# EAGLE schematic flight_computer_board_2017_12_11 (EAGLE 8.4.3)
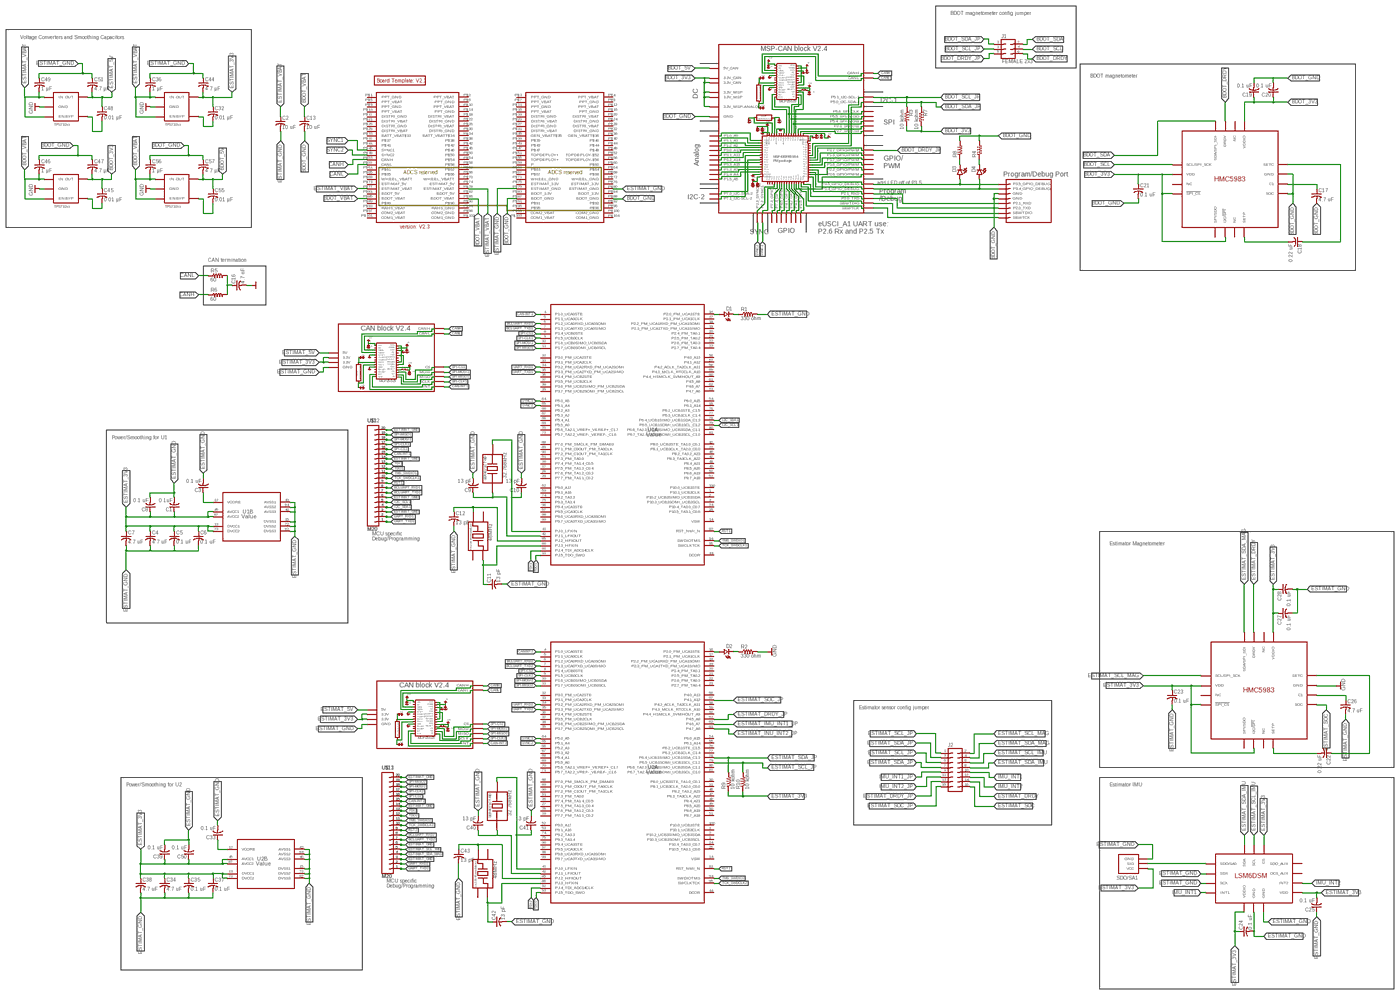
[diagram p0: schematic, sheet 1, overview]
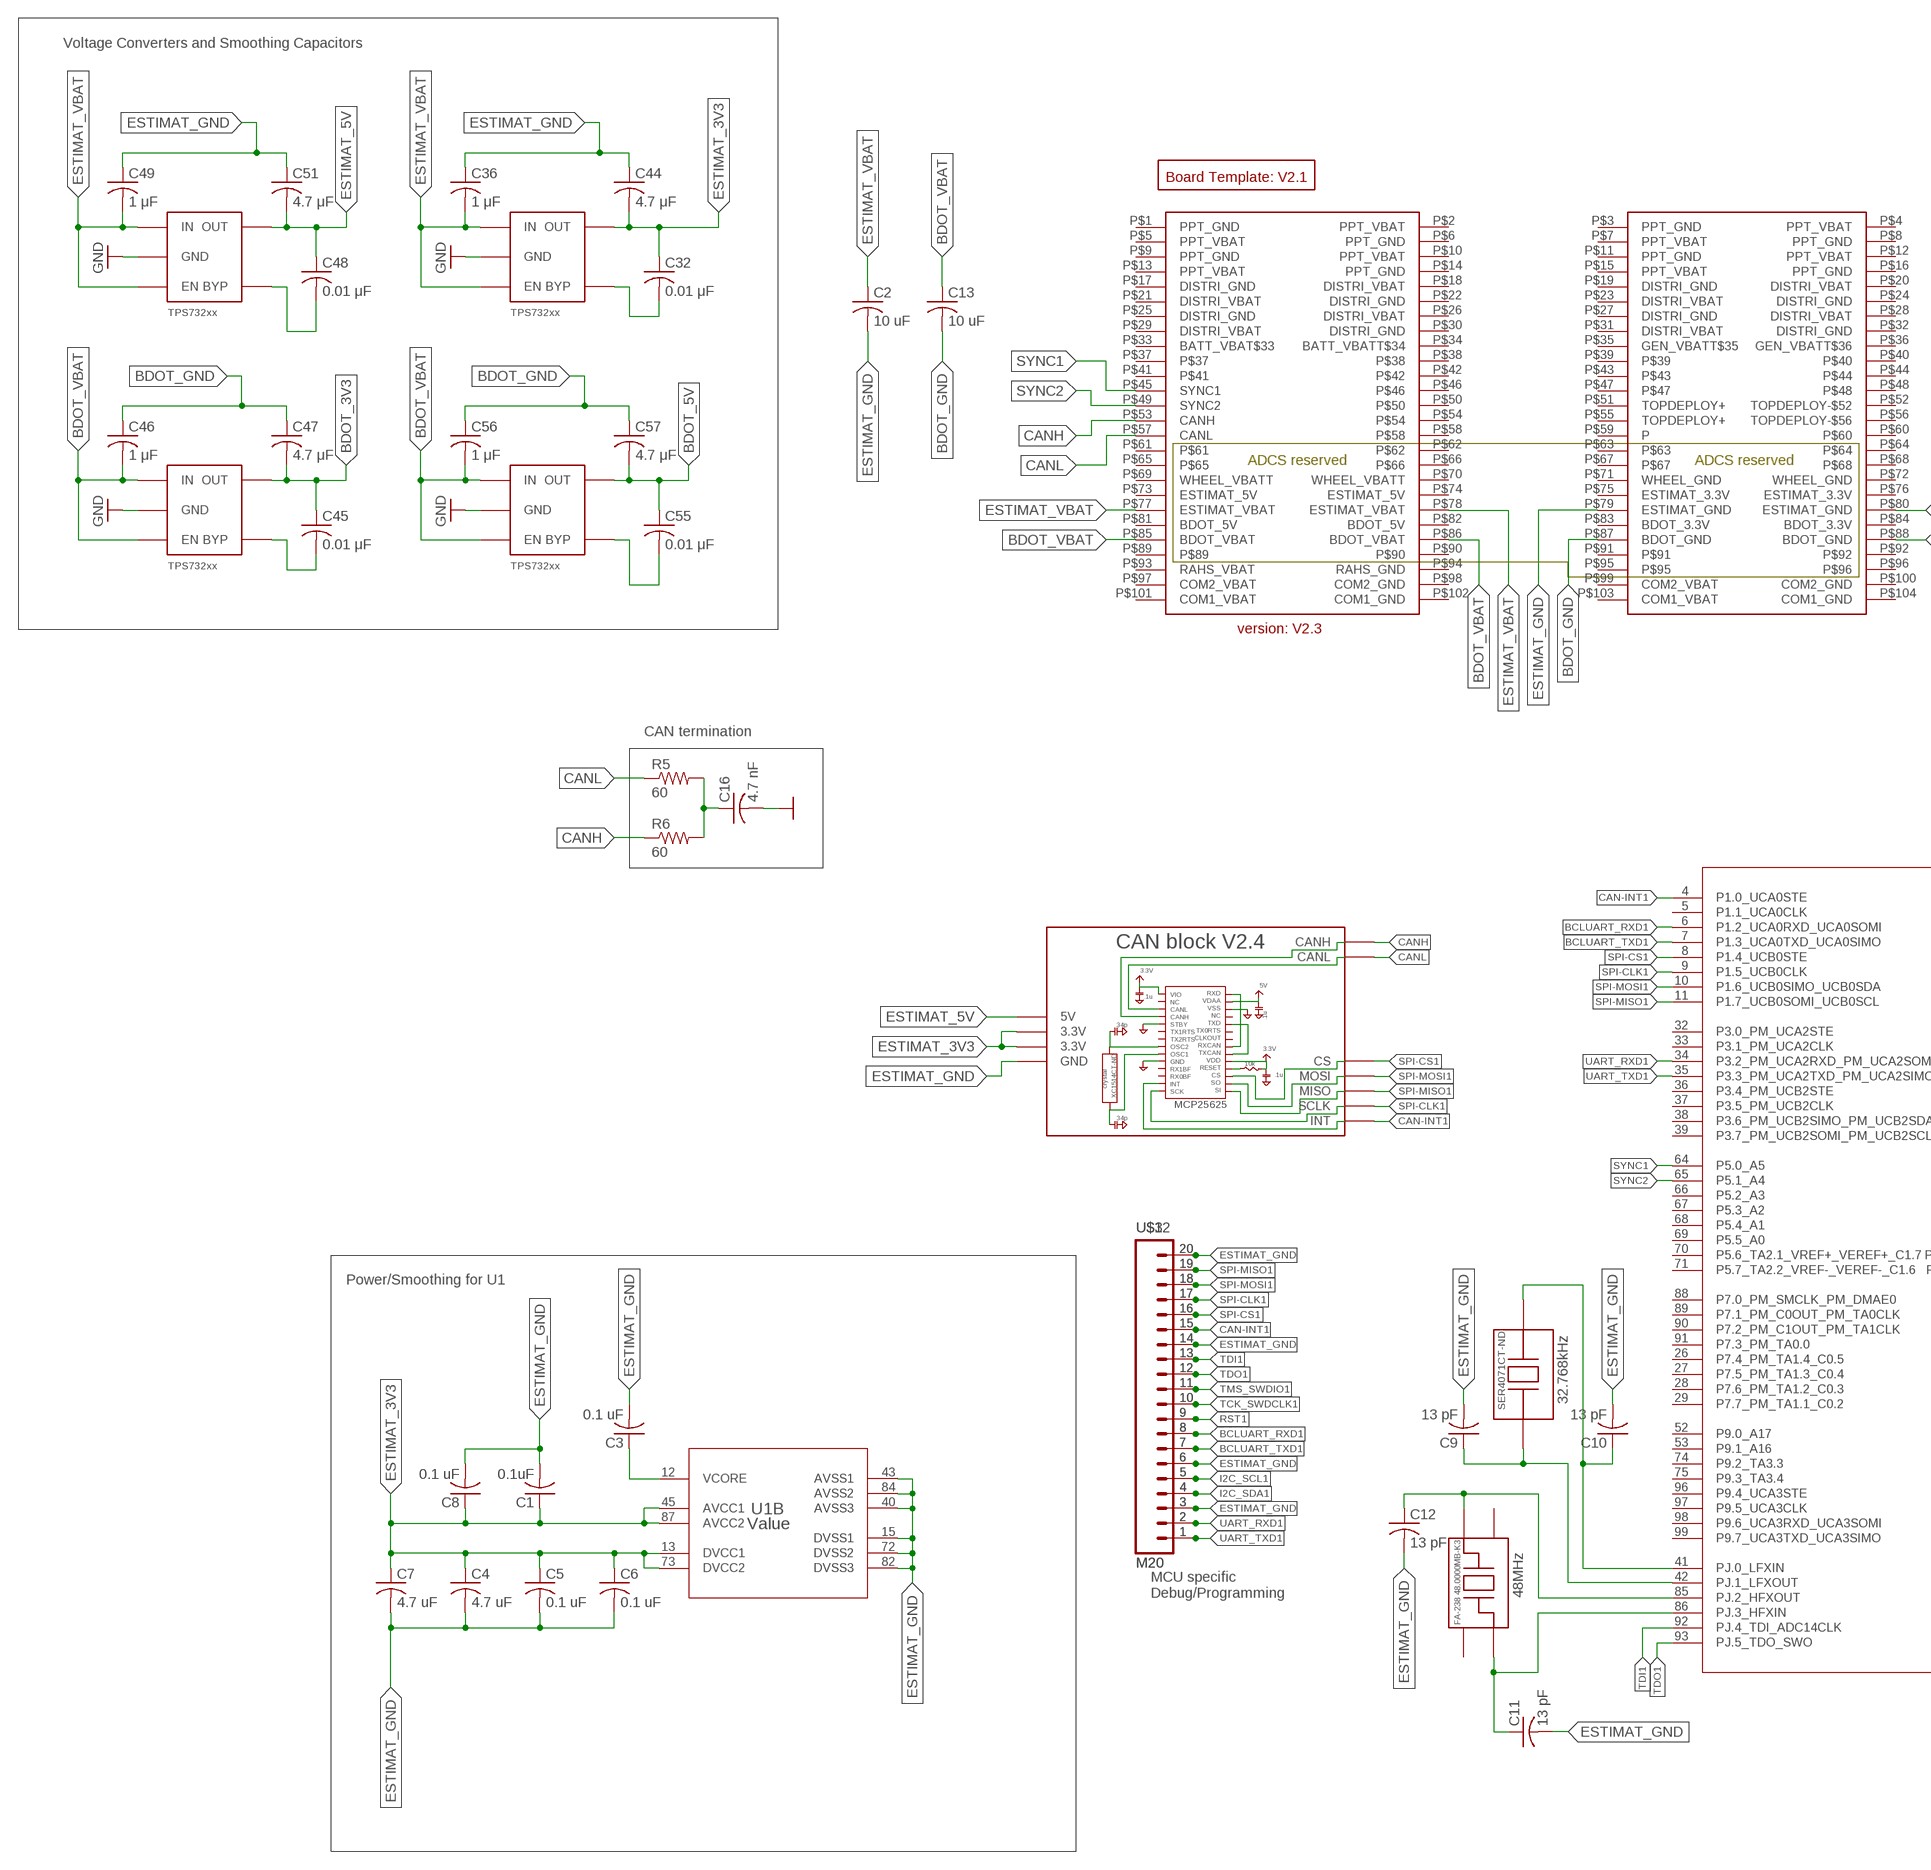
[diagram p1: schematic, sheet 1, part 1 of 4]
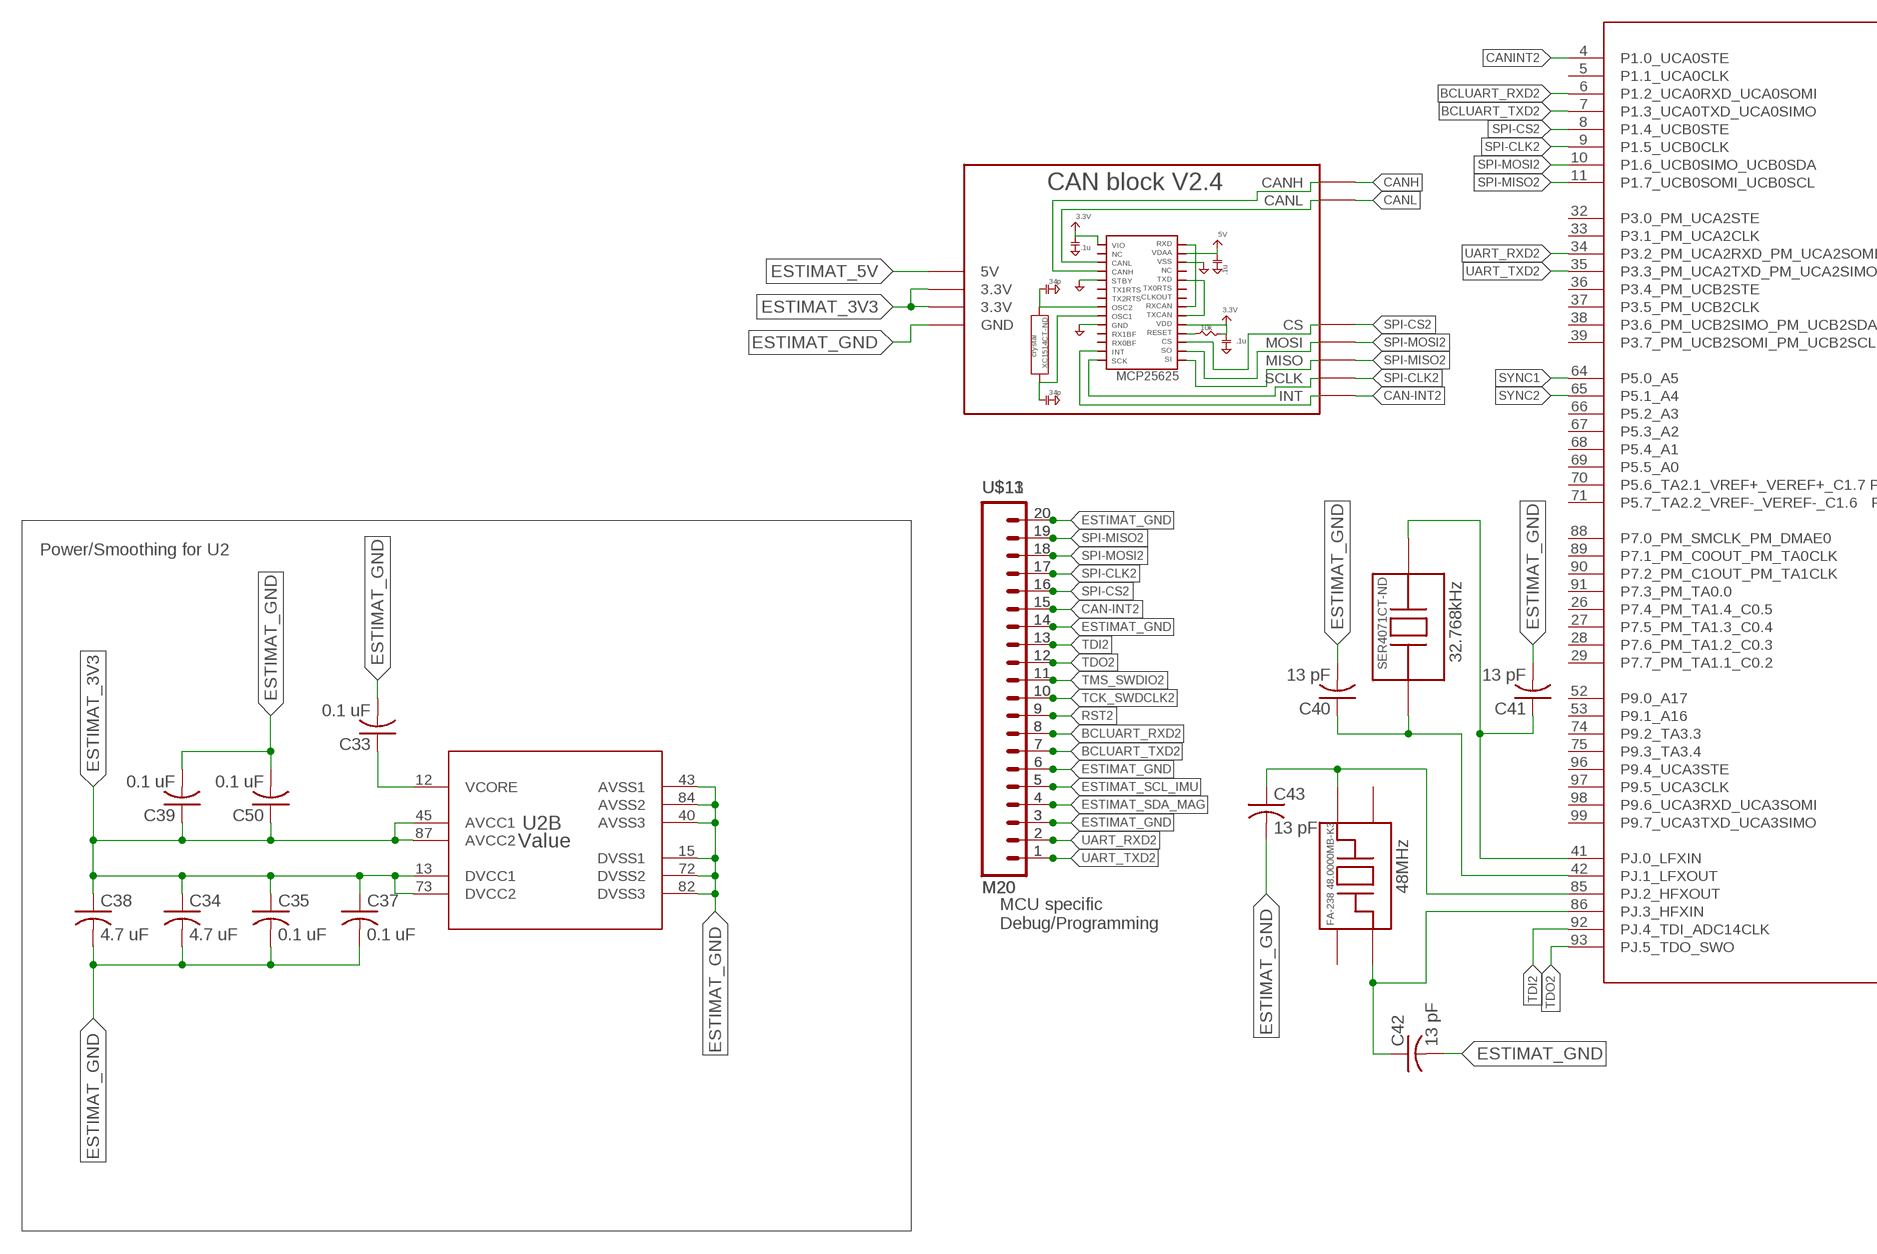
[diagram p2: schematic, sheet 1, part 2 of 4]
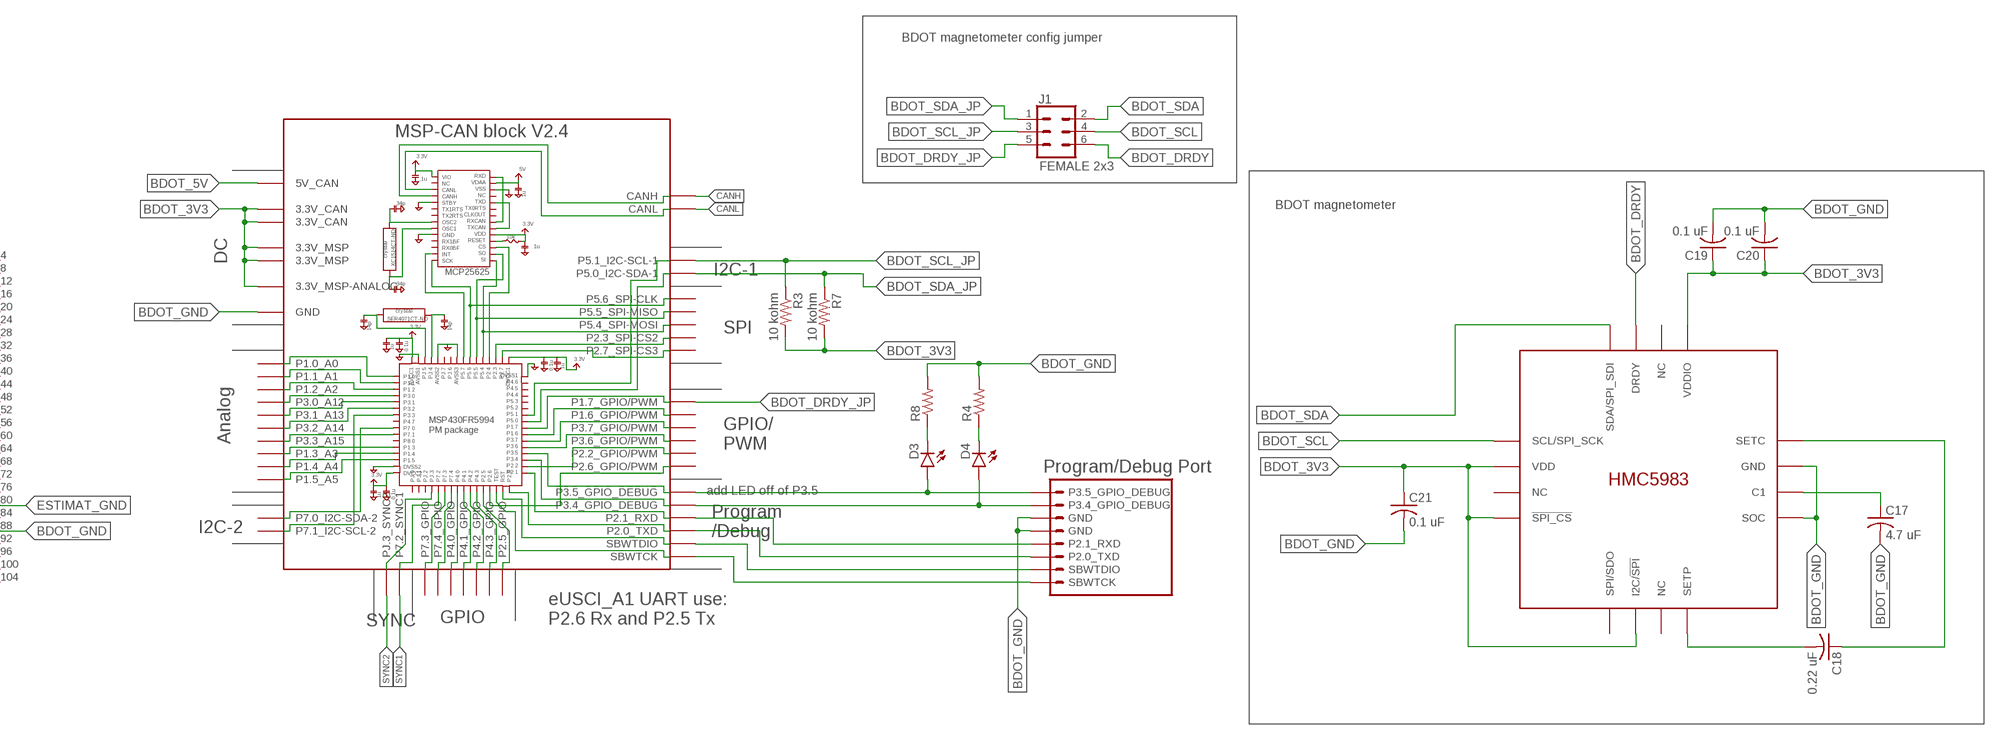
[diagram p3: schematic, sheet 1, part 3 of 4]
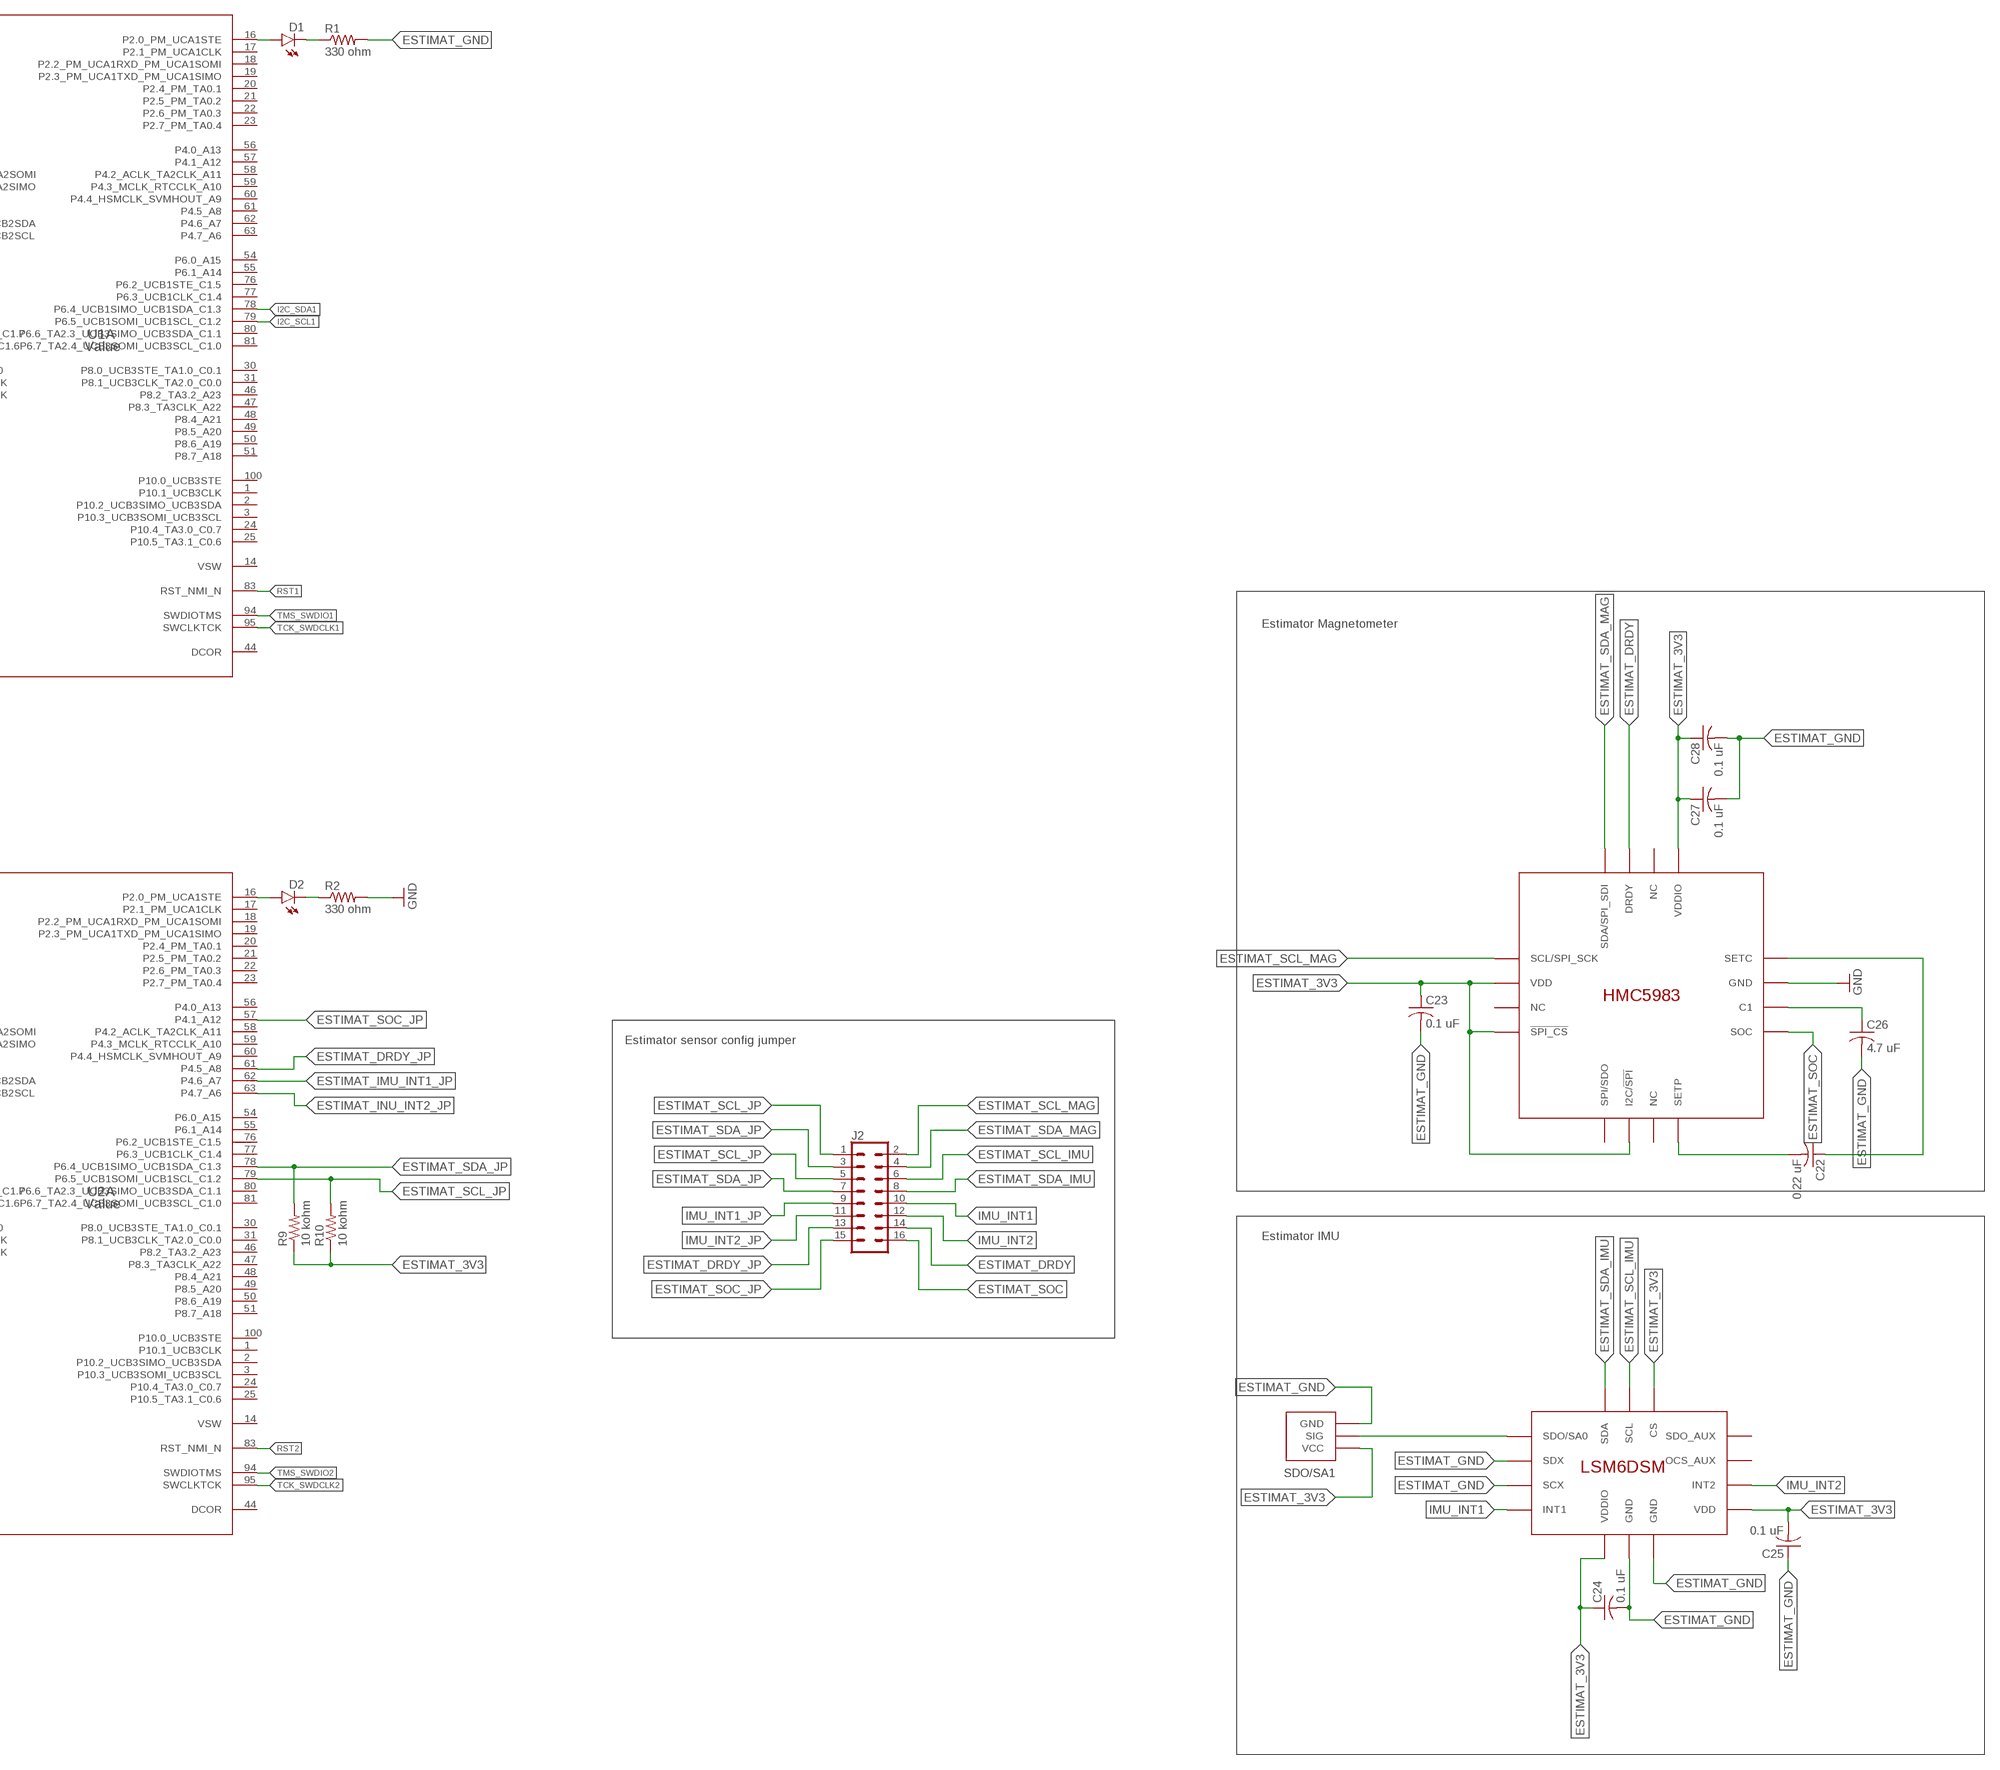
[diagram p4: schematic, sheet 1, part 4 of 4]

## Parts
C1  0.1uF  C-USC0805  [C0805]
C2  10 uF  C-USC0805  [C0805]
C3  0.1 uF  C-USC0805  [C0805]
C4  4.7 uF  C-USC0805  [C0805]
C5  0.1 uF  C-USC0805  [C0805]
C6  0.1 uF  C-USC0805  [C0805]
C7  4.7 uF  C-USC0805  [C0805]
C8  0.1 uF  C-USC0805  [C0805]
C9  13 pF  C-USC0805  [C0805]
C10  13 pF  C-USC0805  [C0805]
C11  13 pF  C-USC0805  [C0805]
C12  13 pF  C-USC0805  [C0805]
C13  10 uF  C-USC0805  [C0805]
C16  4.7 nF  C-USC0805  [C0805]
C17  4.7 uF  C-USC0805  [C0805]
C18  0.22 uF  C-USC0805  [C0805]
C19  0.1 uF  C-USC0805  [C0805]
C20  0.1 uF  C-USC0805  [C0805]
C21  0.1 uF  C-USC0805  [C0805]
C22  0.22 uF  C-USC0805  [C0805]
C23  0.1 uF  C-USC0805  [C0805]
C24  0.1 uF  C-USC0805  [C0805]
C25  0.1 uF  C-USC0805  [C0805]
C26  4.7 uF  C-USC0805  [C0805]
C27  0.1 uF  C-USC0805  [C0805]
C28  0.1 uF  C-USC0805  [C0805]
C32  0.01 μF  C-USC0805  [C0805]
C33  0.1 uF  C-USC0805  [C0805]
C34  4.7 uF  C-USC0805  [C0805]
C35  0.1 uF  C-USC0805  [C0805]
C36  1 μF  C-USC0805  [C0805]
C37  0.1 uF  C-USC0805  [C0805]
C38  4.7 uF  C-USC0805  [C0805]
C39  0.1 uF  C-USC0805  [C0805]
C40  13 pF  C-USC0805  [C0805]
C41  13 pF  C-USC0805  [C0805]
C42  13 pF  C-USC0805  [C0805]
C43  13 pF  C-USC0805  [C0805]
C44  4.7 μF  C-USC0805  [C0805]
C45  0.01 μF  C-USC0805  [C0805]
C46  1 μF  C-USC0805  [C0805]
C47  4.7 μF  C-USC0805  [C0805]
C48  0.01 μF  C-USC0805  [C0805]
C49  1 μF  C-USC0805  [C0805]
C50  0.1 uF  C-USC0805  [C0805]
C51  4.7 μF  C-USC0805  [C0805]
C55  0.01 μF  C-USC0805  [C0805]
C56  1 μF  C-USC0805  [C0805]
C57  4.7 μF  C-USC0805  [C0805]
D1  LED  [LED-1206]
D2  LED  [LED-1206]
D3  LED  [LED-1206]
D4  LED  [LED-1206]
J1  FEMALE 2x3  CONN_03X2FEMALE  [2X3]
J2  CONN_08X2  [2X8]
R1  330 ohm  RESISTOR0805  [0805]
R2  330 ohm  RESISTOR0805  [0805]
R3  10 kohm  RESISTOR0805  [0805]
R4  RESISTOR0805  [0805]
R5  60  RESISTOR0805-RES  [0805]
R6  60  RESISTOR0805-RES  [0805]
R7  10 kohm  RESISTOR0805  [0805]
R8  RESISTOR0805  [0805]
R9  10 kohm  RESISTOR0805  [0805]
R10  10 kohm  RESISTOR0805  [0805]
SDO/SA1  0_OHM_JUMPER  [0_OHM_JUMPER]
U1  Value  MSP432P401R_PZ  [PZ0100A_N]
U2  Value  MSP432P401R_PZ  [PZ0100A_N]
U4  TPS732XX  [SOT-23-5]
U5  TPS732XX  [SOT-23-5]
U6  TPS732XX  [SOT-23-5]
U8  TPS732XX  [SOT-23-5]
U$1  EPSON_CRYSTAL_FC-135R  [FC-135R]
U$2  EPSON_CRYSTAL_FA-238  [FA-238]
U$3  M20  [1X20]
U$4  EPSON_CRYSTAL_FC-135R  [FC-135R]
U$5  BOARD_TEMPLATE1  [BOARD_TEMPLATE]
U$6  PC104_CONNECTOR  [PC104_CONNECTOR]
U$7  MSP-CAN_BLOCK  [MSP-CAN_BLOCK]
U$8  CAN_BLOCK  [CAN_BLOCK]
U$9  EPSON_CRYSTAL_FA-238  [FA-238]
U$10  CAN_BLOCK  [CAN_BLOCK]
U$11  M20  [1X20]
U$12  M20  [1X20]
U$13  M20  [1X20]
U$14  PROGRAM/DEBUG_PORT  [1X08_CONNECTOR]
U$15  HMC5983  [HMC5983]
U$17  LSM6DSM  [LSM6DSM]
U$18  HMC5983  [HMC5983]

## Nets
BCLUART_RXD1: U1.6(A:P1.2_UCA0RXD_UCA0SOMI) U$3.8 U$12.8
BCLUART_RXD2: U2.6(A:P1.2_UCA0RXD_UCA0SOMI) U$11.8 U$13.8
BCLUART_TXD1: U1.7(A:P1.3_UCA0TXD_UCA0SIMO) U$3.7 U$12.7
BCLUART_TXD2: U2.7(A:P1.3_UCA0TXD_UCA0SIMO) U$11.7 U$13.7
BDOT_3V3: C19.1 C20.1 C21.1 C45.1 C47.2 R3.2 R7.2 U5.P$5(OUT) U$7.3.3V@CAN1(3.3V_CAN) U$7.3.3V@CAN2(3.3V_CAN) U$7.3.3V@MSP1(3.3V_MSP) U$7.3.3V@MSP2(3.3V_MSP) U$7.3.3V_ANALOG@MSP2(3.3V_MSP-ANALOG) U$15.!SPI_CS U$15.I2C/!SPI U$15.VDD U$15.VDDIO
BDOT_5V: C55.1 C57.2 U8.P$5(OUT) U$7.5V(5V_CAN)
BDOT_DRDY: J1.6 U$15.DRDY
BDOT_DRDY_JP: J1.5 U$7.P1.7_GPIO/PWM
BDOT_GND: C13.2 C17.2 C19.2 C20.2 C21.2 C46.1 C47.1 C56.1 C57.1 R4.2 R8.2 U5.P$2(GND) U8.P$2(GND) U$6.P$87(BDOT_GND) U$6.P$88(BDOT_GND) U$7.GND@1(GND) U$7.GND@2(GND) U$7.GND@3(GND) U$7.GND@4(GND) U$7.GND@5(GND) U$7.GND@7(GND) U$7.GND@8(GND) U$7.GND@9(GND) U$7.GND@10(GND) U$7.GND@11(GND) U$7.GND@12(GND) U$7.GND@13(GND) U$7.GND@14(GND) U$7.GND@15(GND) U$7.GND@16(GND) U$7.GND@17(GND) U$7.GND@26(GND) U$14.5(GND) U$14.6(GND) U$15.GND U$15.SOC ; supply symbol labelled GND
BDOT_LDO_3V3_BYP: C45.2 U5.P$4(BYP)
BDOT_LDO_5V_BYP: C55.2 U8.P$4(BYP)
BDOT_SCL: J1.4 U$15.SCL/SPI_SCK
BDOT_SCL_JP: J1.3 R3.1 U$7.P5.1_I2C-SCL-1
BDOT_SDA: J1.2 U$15.SDA/SPI_SDI
BDOT_SDA_JP: J1.1 R7.1 U$7.P5.0_I2C-SDA-1
BDOT_VBAT: C13.1 C46.2 C56.2 U5.P$1(IN) U5.P$3(EN) U8.P$1(IN) U8.P$3(EN) U$6.P$85(BDOT_VBAT) U$6.P$86(BDOT_VBAT)
CAN-INT1: U1.4(A:P1.0_UCA0STE) U$3.15 U$8.INT U$12.15
CAN-INT2: U$10.INT U$11.15 U$13.15
CANH: R6.1 U$6.P$53(CANH) U$7.CANH U$8.CANH U$10.CANH
CANINT2: U2.4(A:P1.0_UCA0STE)
CANL: R5.1 U$6.P$57(CANL) U$7.CANL U$8.CANL U$10.CANL
ESTIMAT_3V3: C1.1 C4.1 C5.1 C6.1 C7.1 C8.1 C23.1 C24.1 C25.2 C27.1 C28.1 C32.1 C34.1 C35.1 C37.1 C38.1 C39.1 C44.2 C50.1 R9.1 R10.1 SDO/SA1.P$3(VCC) U1.13(B:DVCC1) U1.45(B:AVCC1) U1.73(B:DVCC2) U1.87(B:AVCC2) U2.13(B:DVCC1) U2.45(B:AVCC1) U2.73(B:DVCC2) U2.87(B:AVCC2) U4.P$5(OUT) U$8.3.3V@CAN1(3.3V) U$8.3.3V@CAN2(3.3V) U$10.3.3V@CAN1(3.3V) U$10.3.3V@CAN2(3.3V) U$17.CS U$17.VDD U$17.VDDIO U$18.!SPI_CS U$18.I2C/!SPI U$18.VDD U$18.VDDIO
ESTIMAT_5V: C48.1 C51.2 U6.P$5(OUT) U$8.5V U$10.5V
ESTIMAT_DRDY: J2.14 U$18.DRDY
ESTIMAT_DRDY_JP: J2.13 U2.61(A:P4.5_A8)
ESTIMAT_GND: C1.2 C2.2 C3.2 C4.2 C5.2 C6.2 C7.2 C8.2 C9.2 C10.2 C11.2 C12.2 C16.2 C23.2 C24.2 C25.1 C26.2 C27.2 C28.2 C33.2 C34.2 C35.2 C36.1 C37.2 C38.2 C39.2 C40.2 C41.2 C42.2 C43.2 C44.1 C49.1 C50.2 C51.1 R1.2 R2.2 SDO/SA1.P$1(GND) U1.15(B:DVSS1) U1.40(B:AVSS3) U1.43(B:AVSS1) U1.72(B:DVSS2) U1.82(B:DVSS3) U1.84(B:AVSS2) U2.15(B:DVSS1) U2.40(B:AVSS3) U2.43(B:AVSS1) U2.72(B:DVSS2) U2.82(B:DVSS3) U2.84(B:AVSS2) U4.P$2(GND) U6.P$2(GND) U$3.3 U$3.6 U$3.14 U$3.20 U$6.P$79(ESTIMAT_GND) U$6.P$80(ESTIMAT_GND) U$8.GND@1(GND) U$8.GND@2(GND) U$8.GND@3(GND) U$8.GND@4(GND) U$8.GND@5(GND) U$8.GND@11(GND) U$8.GND@12(GND) U$8.GND@13(GND) U$10.GND@1(GND) U$10.GND@2(GND) U$10.GND@3(GND) U$10.GND@4(GND) U$10.GND@5(GND) U$10.GND@11(GND) U$10.GND@12(GND) U$10.GND@13(GND) U$11.3 U$11.6 U$11.14 U$11.20 U$12.3 U$12.6 U$12.14 U$12.20 U$13.3 U$13.6 U$13.14 U$13.20 U$17.GND@1(GND) U$17.GND@2(GND) U$17.SCX U$17.SDX U$18.GND ; supply symbol labelled GND
ESTIMAT_IMU_INT1_JP: U2.62(A:P4.6_A7)
ESTIMAT_INU_INT2_JP: U2.63(A:P4.7_A6)
ESTIMAT_LDO_3V3_BYP: C32.2 U4.P$4(BYP)
ESTIMAT_LDO_5V_BYP: C48.2 U6.P$4(BYP)
ESTIMAT_SCL_IMU: J2.6 U$11.5 U$13.5 U$17.SCL
ESTIMAT_SCL_JP: J2.1 J2.5 R10.2 U2.79(A:P6.5_UCB1SOMI_UCB1SCL_C1.2)
ESTIMAT_SCL_MAG: J2.2 U$18.SCL/SPI_SCK
ESTIMAT_SDA_IMU: J2.8 U$17.SDA
ESTIMAT_SDA_JP: J2.3 J2.7 R9.2 U2.78(A:P6.4_UCB1SIMO_UCB1SDA_C1.3)
ESTIMAT_SDA_MAG: J2.4 U$11.4 U$13.4 U$18.SDA/SPI_SDI
ESTIMAT_SOC: J2.16 U$18.SOC
ESTIMAT_SOC_JP: J2.15 U2.57(A:P4.1_A12)
ESTIMAT_VBAT: C2.1 C36.2 C49.2 U4.P$1(IN) U4.P$3(EN) U6.P$1(IN) U6.P$3(EN) U$6.P$77(ESTIMAT_VBAT) U$6.P$78(ESTIMAT_VBAT)
I2C_SCL1: U1.79(A:P6.5_UCB1SOMI_UCB1SCL_C1.2) U$3.5 U$12.5
I2C_SDA1: U1.78(A:P6.4_UCB1SIMO_UCB1SDA_C1.3) U$3.4 U$12.4
IMU_INT1: J2.10 U$17.INT1
IMU_INT1_JP: J2.9
IMU_INT2: J2.12 U$17.INT2
IMU_INT2_JP: J2.11
N$1: D2.A U2.16(A:P2.0_PM_UCA1STE)
N$2: D2.C R2.1
N$3: D1.A U1.16(A:P2.0_PM_UCA1STE)
N$4: D1.C R1.1
N$5: D3.A U$7.P3.5_GPIO_DEBUG U$14.8(P3.5_GPIO_DEBUG)
N$6: D4.A U$7.P3.4_GPIO_DEBUG U$14.7(P3.4_GPIO_DEBUG)
N$7: C3.1 U1.12(B:VCORE)
N$8: C10.1 U1.41(A:PJ.0_LFXIN) U$1.P$2
N$9: C9.1 U1.42(A:PJ.1_LFXOUT) U$1.P$1
N$10: C12.1 U1.85(A:PJ.2_HFXOUT) U$2.P$3
N$11: C11.1 U1.86(A:PJ.3_HFXIN) U$2.P$1
N$12: U$7.P2.1_RXD U$14.4(P2.1_RXD)
N$13: U$7.P2.0_TXD U$14.3(P2.0_TXD)
N$14: U$7.SBWTDIO U$14.2(SBWTDIO)
N$15: U$7.SBWTCK U$14.SBWTCK
N$16: D4.C R4.1
N$17: C16.1 R5.2 R6.2
N$18: D3.C R8.1
N$19: C17.1 U$15.C1
N$20: C18.2 U$15.SETP
N$21: C18.1 U$15.SETC
N$25: SDO/SA1.P$2(SIG) U$17.SDO/SA0
N$34: C26.1 U$18.C1
N$35: C22.2 U$18.SETP
N$36: C22.1 U$18.SETC
N$40: C40.1 U2.42(A:PJ.1_LFXOUT) U$4.P$1
N$41: C41.1 U2.41(A:PJ.0_LFXIN) U$4.P$2
N$42: C42.1 U2.86(A:PJ.3_HFXIN) U$9.P$1
N$43: C43.1 U2.85(A:PJ.2_HFXOUT) U$9.P$3
RST1: U1.83(A:RST_NMI_N) U$3.9 U$12.9
RST2: U2.83(A:RST_NMI_N) U$11.9 U$13.9
SPI-CLK1: U1.9(A:P1.5_UCB0CLK) U$3.17 U$8.CLK(SCLK) U$12.17
SPI-CLK2: U2.9(A:P1.5_UCB0CLK) U$10.CLK(SCLK) U$11.17 U$13.17
SPI-CS1: U1.8(A:P1.4_UCB0STE) U$3.16 U$8.CS U$12.16
SPI-CS2: U2.8(A:P1.4_UCB0STE) U$10.CS U$11.16 U$13.16
SPI-MISO1: U1.11(A:P1.7_UCB0SOMI_UCB0SCL) U$3.19 U$8.MISO U$12.19
SPI-MISO2: U2.11(A:P1.7_UCB0SOMI_UCB0SCL) U$10.MISO U$11.19 U$13.19
SPI-MOSI1: U1.10(A:P1.6_UCB0SIMO_UCB0SDA) U$3.18 U$8.MOSI U$12.18
SPI-MOSI2: U2.10(A:P1.6_UCB0SIMO_UCB0SDA) U$10.MOSI U$11.18 U$13.18
SYNC1: U1.64(A:P5.0_A5) U2.64(A:P5.0_A5) U$6.P$45(SYNC1) U$7.P7.2_SYNC1
SYNC2: U1.65(A:P5.1_A4) U2.65(A:P5.1_A4) U$6.P$49(SYNC2) U$7.PJ.3_SYNC2
TCK_SWDCLK1: U1.95(A:SWCLKTCK) U$3.10 U$12.10
TCK_SWDCLK2: U2.95(A:SWCLKTCK) U$11.10 U$13.10
TDI1: U1.92(A:PJ.4_TDI_ADC14CLK) U$3.13 U$12.13
TDI2: U2.92(A:PJ.4_TDI_ADC14CLK) U$11.13 U$13.13
TDO1: U1.93(A:PJ.5_TDO_SWO) U$3.12 U$12.12
TDO2: U2.93(A:PJ.5_TDO_SWO) U$11.12 U$13.12
TMS_SWDIO1: U1.94(A:SWDIOTMS) U$3.11 U$12.11
TMS_SWDIO2: U2.94(A:SWDIOTMS) U$11.11 U$13.11
UART_RXD1: U1.34(A:P3.2_PM_UCA2RXD_PM_UCA2SOMI) U$3.2 U$12.2
UART_RXD2: U2.34(A:P3.2_PM_UCA2RXD_PM_UCA2SOMI) U$11.2 U$13.2
UART_TXD1: U1.35(A:P3.3_PM_UCA2TXD_PM_UCA2SIMO) U$3.1 U$12.1
UART_TXD2: U2.35(A:P3.3_PM_UCA2TXD_PM_UCA2SIMO) U$11.1 U$13.1
VCORE: C33.1 U2.12(B:VCORE)
Unconnected: U1.1(A:P10.1_UCB3CLK) U1.2(A:P10.2_UCB3SIMO_UCB3SDA) U1.3(A:P10.3_UCB3SOMI_UCB3SCL) U1.5(A:P1.1_UCA0CLK) U1.14(A:VSW) U1.17(A:P2.1_PM_UCA1CLK) U1.18(A:P2.2_PM_UCA1RXD_PM_UCA1SOMI) U1.19(A:P2.3_PM_UCA1TXD_PM_UCA1SIMO) U1.20(A:P2.4_PM_TA0.1) U1.21(A:P2.5_PM_TA0.2) U1.22(A:P2.6_PM_TA0.3) U1.23(A:P2.7_PM_TA0.4) U1.24(A:P10.4_TA3.0_C0.7) U1.25(A:P10.5_TA3.1_C0.6) U1.26(A:P7.4_PM_TA1.4_C0.5) U1.27(A:P7.5_PM_TA1.3_C0.4) U1.28(A:P7.6_PM_TA1.2_C0.3) U1.29(A:P7.7_PM_TA1.1_C0.2) U1.30(A:P8.0_UCB3STE_TA1.0_C0.1) U1.31(A:P8.1_UCB3CLK_TA2.0_C0.0) U1.32(A:P3.0_PM_UCA2STE) U1.33(A:P3.1_PM_UCA2CLK) U1.36(A:P3.4_PM_UCB2STE) U1.37(A:P3.5_PM_UCB2CLK) U1.38(A:P3.6_PM_UCB2SIMO_PM_UCB2SDA) U1.39(A:P3.7_PM_UCB2SOMI_PM_UCB2SCL) U1.44(A:DCOR) U1.46(A:P8.2_TA3.2_A23) U1.47(A:P8.3_TA3CLK_A22) U1.48(A:P8.4_A21) U1.49(A:P8.5_A20) U1.50(A:P8.6_A19) U1.51(A:P8.7_A18) U1.52(A:P9.0_A17) U1.53(A:P9.1_A16) U1.54(A:P6.0_A15) U1.55(A:P6.1_A14) U1.56(A:P4.0_A13) U1.57(A:P4.1_A12) U1.58(A:P4.2_ACLK_TA2CLK_A11) U1.59(A:P4.3_MCLK_RTCCLK_A10) U1.60(A:P4.4_HSMCLK_SVMHOUT_A9) U1.61(A:P4.5_A8) U1.62(A:P4.6_A7) U1.63(A:P4.7_A6) U1.66(A:P5.2_A3) U1.67(A:P5.3_A2) U1.68(A:P5.4_A1) U1.69(A:P5.5_A0) U1.70(A:P5.6_TA2.1_VREF+_VEREF+_C1.7) U1.71(A:P5.7_TA2.2_VREF-_VEREF-_C1.6) U1.74(A:P9.2_TA3.3) U1.75(A:P9.3_TA3.4) U1.76(A:P6.2_UCB1STE_C1.5) U1.77(A:P6.3_UCB1CLK_C1.4) U1.80(A:P6.6_TA2.3_UCB3SIMO_UCB3SDA_C1.1) U1.81(A:P6.7_TA2.4_UCB3SOMI_UCB3SCL_C1.0) U1.88(A:P7.0_PM_SMCLK_PM_DMAE0) U1.89(A:P7.1_PM_C0OUT_PM_TA0CLK) U1.90(A:P7.2_PM_C1OUT_PM_TA1CLK) U1.91(A:P7.3_PM_TA0.0) U1.96(A:P9.4_UCA3STE) U1.97(A:P9.5_UCA3CLK) U1.98(A:P9.6_UCA3RXD_UCA3SOMI) U1.99(A:P9.7_UCA3TXD_UCA3SIMO) U1.100(A:P10.0_UCB3STE) U2.1(A:P10.1_UCB3CLK) U2.2(A:P10.2_UCB3SIMO_UCB3SDA) U2.3(A:P10.3_UCB3SOMI_UCB3SCL) U2.5(A:P1.1_UCA0CLK) U2.14(A:VSW) U2.17(A:P2.1_PM_UCA1CLK) U2.18(A:P2.2_PM_UCA1RXD_PM_UCA1SOMI) U2.19(A:P2.3_PM_UCA1TXD_PM_UCA1SIMO) U2.20(A:P2.4_PM_TA0.1) U2.21(A:P2.5_PM_TA0.2) U2.22(A:P2.6_PM_TA0.3) U2.23(A:P2.7_PM_TA0.4) U2.24(A:P10.4_TA3.0_C0.7) U2.25(A:P10.5_TA3.1_C0.6) U2.26(A:P7.4_PM_TA1.4_C0.5) U2.27(A:P7.5_PM_TA1.3_C0.4) U2.28(A:P7.6_PM_TA1.2_C0.3) U2.29(A:P7.7_PM_TA1.1_C0.2) U2.30(A:P8.0_UCB3STE_TA1.0_C0.1) U2.31(A:P8.1_UCB3CLK_TA2.0_C0.0) U2.32(A:P3.0_PM_UCA2STE) U2.33(A:P3.1_PM_UCA2CLK) U2.36(A:P3.4_PM_UCB2STE) U2.37(A:P3.5_PM_UCB2CLK) U2.38(A:P3.6_PM_UCB2SIMO_PM_UCB2SDA) U2.39(A:P3.7_PM_UCB2SOMI_PM_UCB2SCL) U2.44(A:DCOR) U2.46(A:P8.2_TA3.2_A23) U2.47(A:P8.3_TA3CLK_A22) U2.48(A:P8.4_A21) U2.49(A:P8.5_A20) U2.50(A:P8.6_A19) U2.51(A:P8.7_A18) U2.52(A:P9.0_A17) U2.53(A:P9.1_A16) U2.54(A:P6.0_A15) U2.55(A:P6.1_A14) U2.56(A:P4.0_A13) U2.58(A:P4.2_ACLK_TA2CLK_A11) U2.59(A:P4.3_MCLK_RTCCLK_A10) U2.60(A:P4.4_HSMCLK_SVMHOUT_A9) U2.66(A:P5.2_A3) U2.67(A:P5.3_A2) U2.68(A:P5.4_A1) U2.69(A:P5.5_A0) U2.70(A:P5.6_TA2.1_VREF+_VEREF+_C1.7) U2.71(A:P5.7_TA2.2_VREF-_VEREF-_C1.6) U2.74(A:P9.2_TA3.3) U2.75(A:P9.3_TA3.4) U2.76(A:P6.2_UCB1STE_C1.5) U2.77(A:P6.3_UCB1CLK_C1.4) U2.80(A:P6.6_TA2.3_UCB3SIMO_UCB3SDA_C1.1) U2.81(A:P6.7_TA2.4_UCB3SOMI_UCB3SCL_C1.0) U2.88(A:P7.0_PM_SMCLK_PM_DMAE0) U2.89(A:P7.1_PM_C0OUT_PM_TA0CLK) U2.90(A:P7.2_PM_C1OUT_PM_TA1CLK) U2.91(A:P7.3_PM_TA0.0) U2.96(A:P9.4_UCA3STE) U2.97(A:P9.5_UCA3CLK) U2.98(A:P9.6_UCA3RXD_UCA3SOMI) U2.99(A:P9.7_UCA3TXD_UCA3SIMO) U2.100(A:P10.0_UCB3STE) U$2.P$2 U$2.P$4 U$6.P$1(PPT_GND) U$6.P$2(PPT_VBAT) U$6.P$3(PPT_GND) U$6.P$4(PPT_VBAT) U$6.P$5(PPT_VBAT) U$6.P$6(PPT_GND) U$6.P$7(PPT_VBAT) U$6.P$8(PPT_GND) U$6.P$9(PPT_GND) U$6.P$10(PPT_VBAT) U$6.P$11(PPT_GND) U$6.P$12(PPT_VBAT) U$6.P$13(PPT_VBAT) U$6.P$14(PPT_GND) U$6.P$15(PPT_VBAT) U$6.P$16(PPT_GND) U$6.P$17(DISTRI_GND) U$6.P$18(DISTRI_VBAT) U$6.P$19(DISTRI_GND) U$6.P$20(DISTRI_VBAT) U$6.P$21(DISTRI_VBAT) U$6.P$22(DISTRI_GND) U$6.P$23(DISTRI_VBAT) U$6.P$24(DISTRI_GND) U$6.P$25(DISTRI_GND) U$6.P$26(DISTRI_VBAT) U$6.P$27(DISTRI_GND) U$6.P$28(DISTRI_VBAT) U$6.P$29(DISTRI_VBAT) U$6.P$30(DISTRI_GND) U$6.P$31(DISTRI_VBAT) U$6.P$32(DISTRI_GND) U$6.P$33(BATT_VBAT$33) U$6.P$34(BATT_VBATT$34) U$6.P$35(GEN_VBATT$35) U$6.P$36(GEN_VBATT$36) U$6.P$37 U$6.P$38 U$6.P$39 U$6.P$40 U$6.P$41 U$6.P$42 U$6.P$43 U$6.P$44 U$6.P$46 U$6.P$47 U$6.P$48 U$6.P$50 U$6.P$51(TOPDEPLOY+) U$6.P$52(TOPDEPLOY-$52) U$6.P$54 U$6.P$55(TOPDEPLOY+) U$6.P$56(TOPDEPLOY-$56) U$6.P$58 U$6.P$59(P) U$6.P$60 U$6.P$61 U$6.P$62 U$6.P$63 U$6.P$64 U$6.P$65 U$6.P$66 U$6.P$67 U$6.P$68 U$6.P$69(WHEEL_VBATT) U$6.P$70(WHEEL_VBATT) U$6.P$71(WHEEL_GND) U$6.P$72(WHEEL_GND) U$6.P$73(ESTIMAT_5V) U$6.P$74(ESTIMAT_5V) U$6.P$75(ESTIMAT_3.3V) U$6.P$76(ESTIMAT_3.3V) U$6.P$81(BDOT_5V) U$6.P$82(BDOT_5V) U$6.P$83(BDOT_3.3V) U$6.P$84(BDOT_3.3V) U$6.P$89 U$6.P$90 U$6.P$91 U$6.P$92 U$6.P$93(RAHS_VBAT) U$6.P$94(RAHS_GND) U$6.P$95 U$6.P$96 U$6.P$97(COM2_VBAT) U$6.P$98(COM2_GND) U$6.P$99(COM2_VBAT) U$6.P$100(COM2_GND) U$6.P$101(COM1_VBAT) U$6.P$102(COM1_GND) U$6.P$103(COM1_VBAT) U$6.P$104(COM1_GND) U$7.P1.0_A0 U$7.P1.1_A1 U$7.P1.2_A2 U$7.P1.3_A3 U$7.P1.4_A4 U$7.P1.5_A5 U$7.P1.6_GPIO/PWM U$7.P2.2_GPIO/PWM U$7.P2.4_SPI-CS2(P2.3_SPI-CS2) U$7.P2.5_GPIO U$7.P2.6_GPIO/PWM U$7.P2.7_SPI-CS3 U$7.P3.0_A12 U$7.P3.1_A13 U$7.P3.2_A14 U$7.P3.3_A15 U$7.P3.6_GPIO/PWM U$7.P3.7_GPIO/PWM U$7.P4.0_GPIO U$7.P4.1_GPIO U$7.P4.2_GPIO U$7.P4.3_GPIO U$7.P5.4_SPI-MOSI U$7.P5.5_SPI-MISO U$7.P5.6_SPI-CLK U$7.P7.0_I2C-SDA-2 U$7.P7.1_I2C-SCL-2 U$7.P7.3_GPIO U$7.P7.4_GPIO U$9.P$2 U$9.P$4 U$15.NC@1(NC) U$15.NC@2(NC) U$15.NC@3(NC) U$15.SPI_SDO(SPI/SDO) U$17.OCS_AUX U$17.SDO_AUX U$18.NC@1(NC) U$18.NC@2(NC) U$18.NC@3(NC) U$18.SPI_SDO(SPI/SDO)

## Notes on the sheet
- BDOT magnetometer config jumper
- Voltage Converters and Smoothing Capacitors
- BDOT magnetometer
- CAN termination
- Power/Smoothing for U1
- MCU specific 
  Debug/Programming
- Estimator Magnetometer
- Estimator sensor config jumper
- Power/Smoothing for U2 | Estimator IMU
- MCU specific 
  Debug/Programming

## Library data of the parts
C1-C13 C16-C28 C32-C51 C55-C57 = rcl:C-US: CAPACITOR, American symbol
D1-D4 = DubSat1 Components:LED
J1 = SparkFun-Connectors:CONN_03X2: Multi connection point. Often used as Generic Header-pin footprint for 0.1 inch spaced/style header connections You can populate with any combo of single row headers, but if you'd like an exact match, check these: Header - 2x3 (Male, 0.1") <https://www.sparkfun.com/products/12807> (PRT-12807) Header - 2x3 (Female, 0.1") <https://www.sparkfun.com/products/13010> (PRT-13010) 2x3 Pin Shrouded Header <https://www.sparkfun.com/products/10877> (PRT-10877) On any of the 0.1 inch spaced packages, you can populate with these: Break Away Headers - Straight <https://www.sparkfun.com/products/116> (PRT-00116) Break Away Male Headers - Right Angle <https://www.sparkfun.com/products/553> (PRT-00553) Female Headers <https://www.sparkfun.com/products/115> (PRT-00115) Break Away Headers - Machine Pin <https://www.sparkfun.com/products/117> (PRT-00117) Break Away Female Headers - Swiss Machine Pin <https://www.sparkfun.com/products/743> (PRT-00743) Special note: the shrouded connector mates well with our 3x2 ribbon cables: Ribbon Crimp Connector - 6-pin (2x3, Female) <https://www.sparkfun.com/products/10651> (PRT-10651) Ribbon Cable - 6 wire (15ft) <https://www.sparkfun.com/products/10646> (PRT-10646); PROD_ID: CONN-11566
J2 = SparkFun-Connectors:CONN_08X2: Multi connection point. Often used as Generic Header-pin footprint for 0.1 inch spaced/style header connections You can populate with any combo of single row headers, but if you'd like an exact match, check this: Header - 2x8 (Male, 0.1") <https://www.sparkfun.com/products/13156> (PRT-13156) On any of the 0.1 inch spaced packages, you can populate with these: Break Away Headers - Straight <https://www.sparkfun.com/products/116> (PRT-00116) Break Away Male Headers - Right Angle <https://www.sparkfun.com/products/553> (PRT-00553) Female Headers <https://www.sparkfun.com/products/115> (PRT-00115) Break Away Headers - Machine Pin <https://www.sparkfun.com/products/117> (PRT-00117) Break Away Female Headers - Swiss Machine Pin <https://www.sparkfun.com/products/743> (PRT-00743)
R1-R4 R7-R10 = DubSat1 Components:RESISTOR: Resistor Basic schematic elements and footprints for 0603, 1206, and PTH resistors.
R5 R6 = SparkFun-Resistors:RESISTOR: Resistor Basic schematic elements and footprints for 0603, 1206, and PTH resistors.
SDO/SA1 = DubSat1 Components:0_OHM_JUMPER
U1 U2 = DubSat1 Components:MSP432P401R_PZ; COMPTYPE: IC; MANUFACTURER: Texas Instruments; MOUNTTYPE: SMT; PACKAGEREFERENCE: PZ0100A; PARTNUMBER: XMS432P401RIPZR; PIN_COUNT: 100; REFDES: RefDes; TYPE: TYPE
U4-U6 U8 = DubSat1 Components:TPS732XX
U$1 U$4 = DubSat1 Components:EPSON_CRYSTAL_FC-135R
U$2 U$9 = DubSat1 Components:EPSON_CRYSTAL_FA-238
U$3 U$11-U$13 = SparkFun-Connectors:M20: 1x20 .1" header This is just like the LOCK variant in that the holes are staggared by 5 mil, but except for the last two holes. They are not altered from the "standard" footprint layout. This is used for a special purpose on the layout of our Graphic LCD Backpack. Make sure you want to use this device before selecting it for you project!
U$5 = DubSat1 Components:BOARD_TEMPLATE
U$6 = DubSat1 Components:PC104_CONNECTOR
U$7 = DubSat1 Components:MSP-CAN_BLOCK
U$8 U$10 = DubSat1 Components:CAN_BLOCK
U$14 = DubSat1 Components:PROGRAM/DEBUG_PORT
U$15 U$18 = DubSat1 Components:HMC5983
U$17 = LSM6DSM:LSM6DSM

## Net classes
0 default: width 0.254 mm, drill 0.254 mm, clearance 0.152 mm